# Altium project DB10005_DieBieMS.PrjPcb
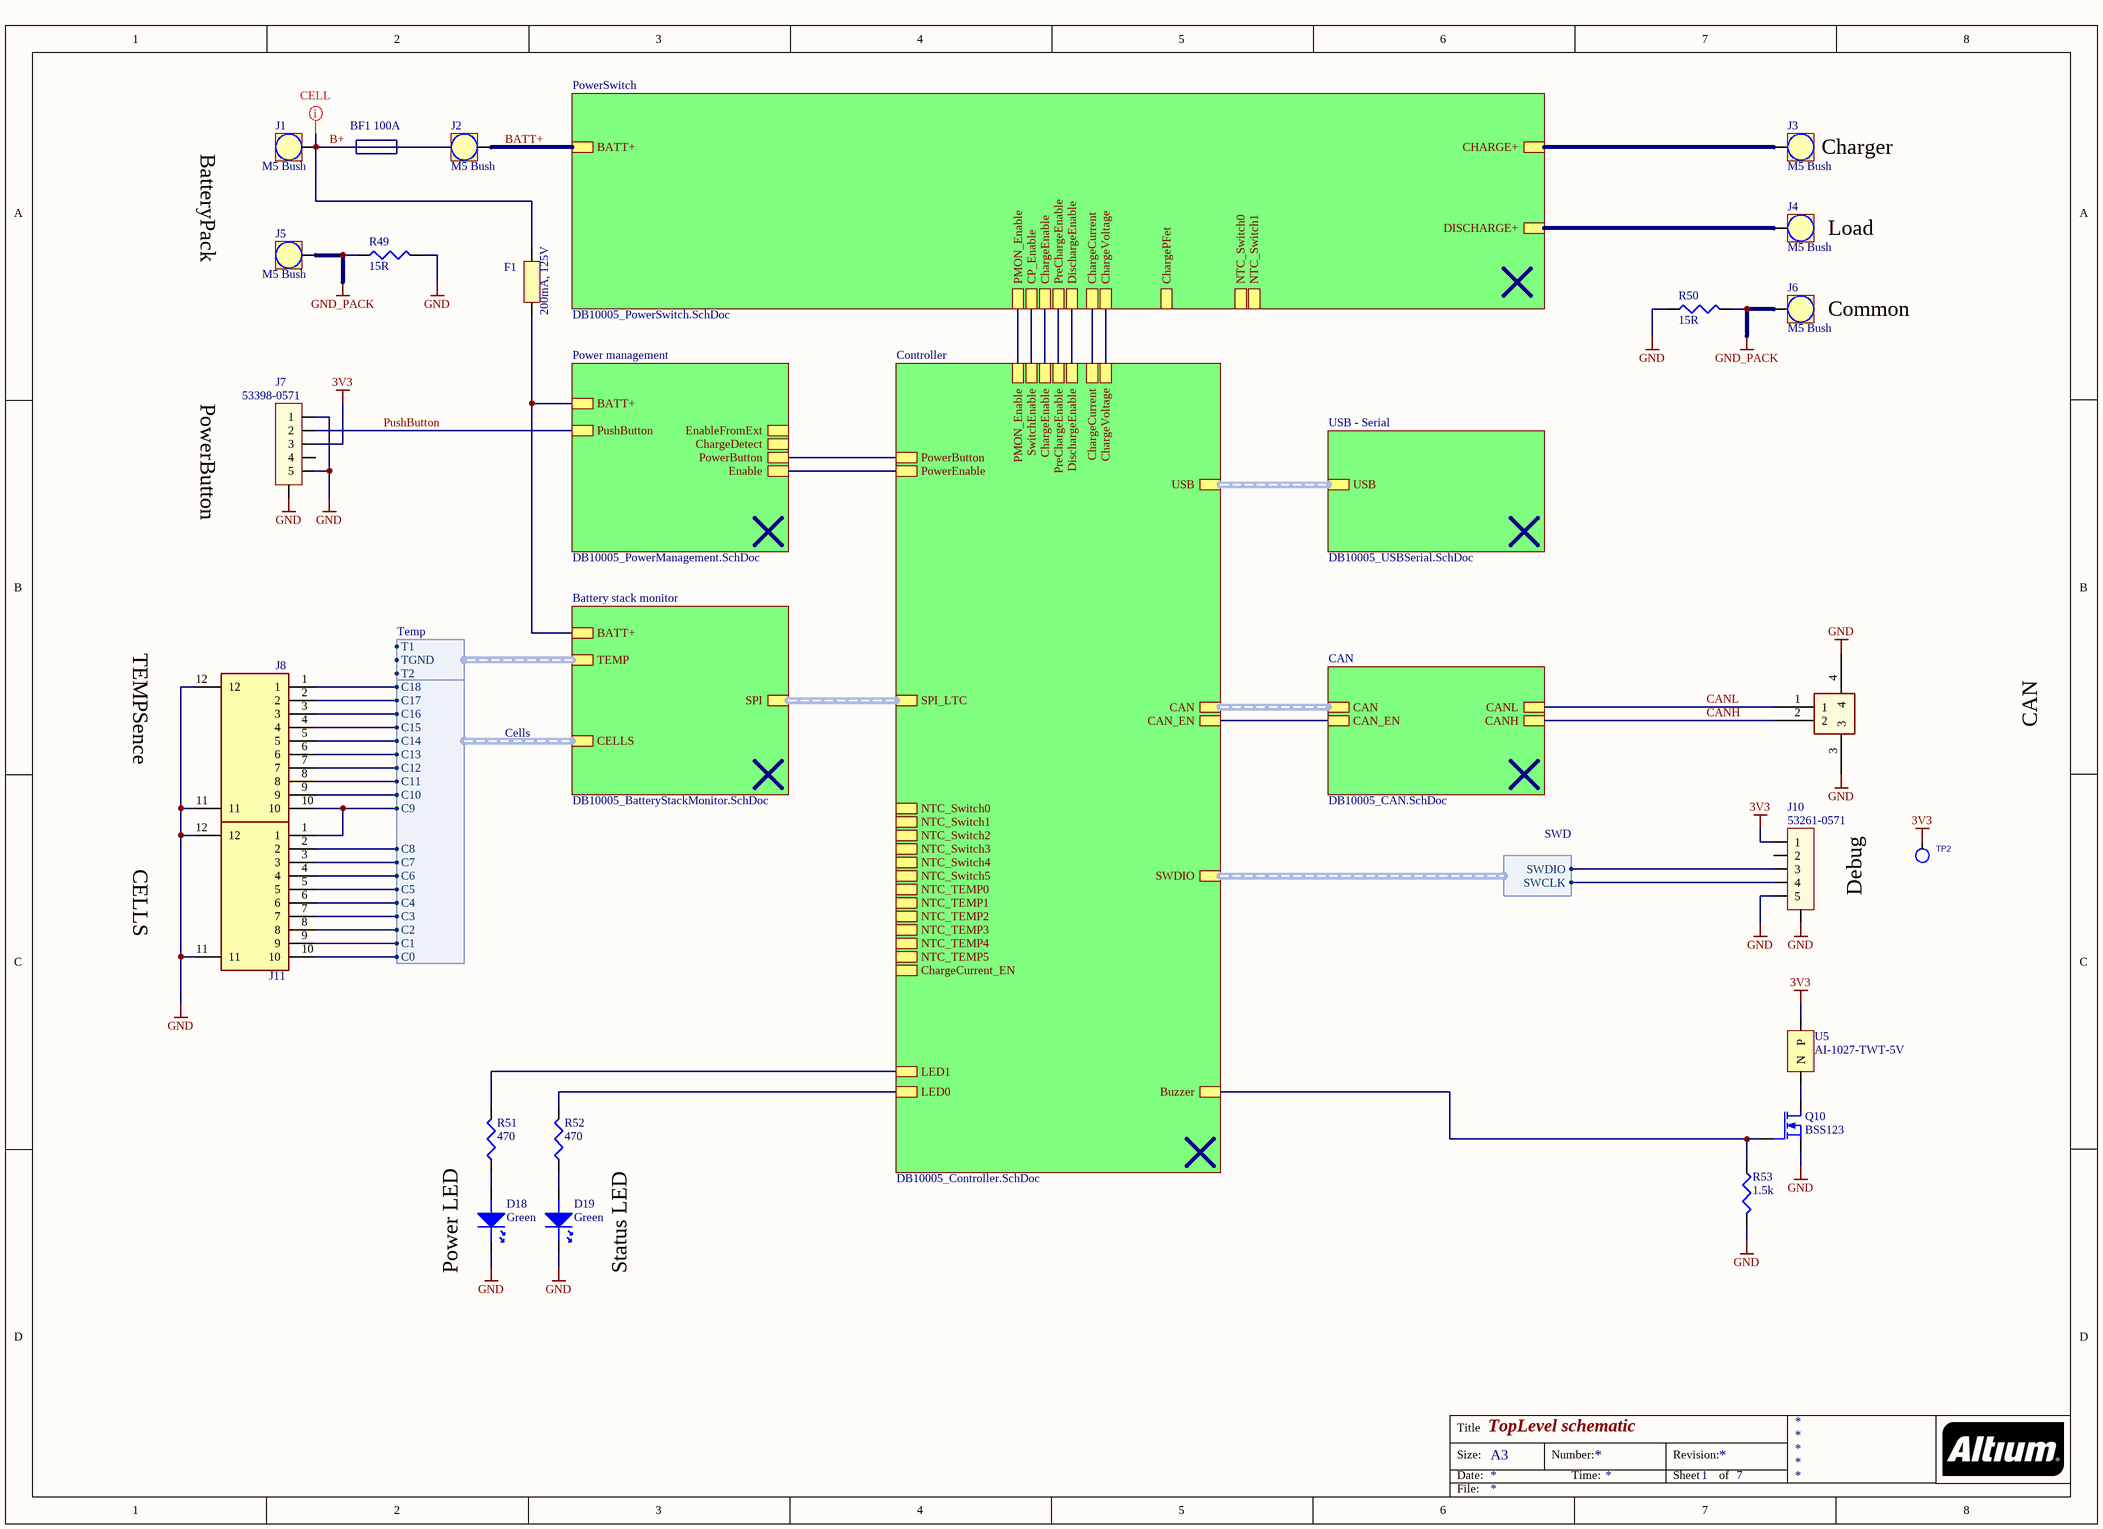
[diagram p0: DB10005_TopLevel.SchDoc]
4 sheets, 51 parts. Net scope: hierarchical (ports join the sheet entries above them; power ports are global).
Board file: DB10005_BMS.PcbDoc
Sheets:
  DB10005_TopLevel.SchDoc
    Battery stack monitor = DB10005_BatteryStackMonitor.SchDoc
    CAN = DB10005_CAN.SchDoc
    USB - Serial = DB10005_USBSerial.SchDoc

## Sheet DB10005_TopLevel.SchDoc: TopLevel schematic
size A3; SheetNumber: 1; SheetTotal: 7

### Parts
D18  Green  [D-0805]
D19  Green  [D-0805]
F1  200mA, 125V  [F1206]
J1  M5 Bush  [7460408_HAL Surface]
J2  M5 Bush  [7460408_HAL Surface]
J3  M5 Bush  [7460408_HAL Surface]
J4  M5 Bush  [7460408_HAL Surface]
J5  M5 Bush  [7460408_HAL Surface]
J6  M5 Bush  [7460408_HAL Surface]
J7  53398-0571  [53398-0571]
J8  S10B-PH-SM4-TB_LF__SN_  [S10B-PH-SM4-TB]  (value not drawn)
J9  1.25-2PWTDK  [BM02B-GHS-TBT_1]  (value not drawn)
J10  53261-0571  [53261-0571]
J11  S10B-PH-SM4-TB_LF__SN_  [S10B-PH-SM4-TB]  (value not drawn)
Q10  BSS123  [SOT-23]
R49  15R  [2512]
R50  15R  [2512]
R51  470  [0402]
R52  470  [0402]
R53  1.5k  [0402]
TP2  1.3TP  [TP2-1.3MM]  (value not drawn)  (no BOM)
U5  AI-1027-TWT-5V  [AI-1027-TWT]

### Sub-sheets
Battery stack monitor = DB10005_BatteryStackMonitor.SchDoc: SPI (harness SPI), CELLS (harness Cells), TEMP (harness Temp), BATT+
CAN = DB10005_CAN.SchDoc: CANH, CAN (harness CAN), CANL, CAN_EN
Controller = DB10005_Controller.SchDoc (file not in this document): SPI_LTC (harness SPI), PowerEnable, PowerButton, DischargeEnable, ChargeEnable, SwitchEnable, PreChargeEnable, CAN (harness CAN), LED0, SWDIO (harness SWD), Buzzer, LED1, PMON_Enable, CAN_EN, ChargeCurrent, ChargeVoltage, NTC_Switch0, NTC_Switch1, NTC_Switch2, NTC_Switch3, NTC_Switch4, NTC_Switch5, NTC_TEMP0, NTC_TEMP1, NTC_TEMP2, NTC_TEMP3, NTC_TEMP4, NTC_TEMP5, ChargeCurrent_EN, USB (harness USB)
Power management = DB10005_PowerManagement.SchDoc (file not in this document): Enable, PowerButton, ChargeDetect, EnableFromExt, PushButton, BATT+
PowerSwitch = DB10005_PowerSwitch.SchDoc (file not in this document): DischargeEnable, ChargeEnable, PreChargeEnable, CHARGE+, DISCHARGE+, BATT+, ChargePFet, CP_Enable, PMON_Enable, NTC_Switch0, NTC_Switch1, ChargeCurrent, ChargeVoltage
USB - Serial = DB10005_USBSerial.SchDoc: USB (harness USB)

### Harnesses
Cells: C1, C9, C2, C3, C4, C5, C6, C7, C8, C10, C11, C0, C12, C13, C14, C15, C16, C17, C18
Temp: T1, T2, TGND
SWD: SWCLK, SWDIO

### Nets
3V3: J7.3 J10.1 TP2.1(TP) U5.P
GND: D18.K D19.K J7.0(SHLD) J7.1 J7.5 J8.11 J8.12 J9.3 J9.4 J10.0(SHLD) J10.5 J11.11 J11.12 Q10.S R49.2 R50.2 R53.2
GND_PACK: J5.1 J6.1 R49.1 R50.1
B+: F1.2 J1.1
BATT+: J2.1 ; sheet PowerSwitch/BATT+
CANH: J9.2 ; sheet CAN/CANH
CANL: J9.1 ; sheet CAN/CANL
CN1: J11.10 ; sheet Battery stack monitor/CELLS.C0
CN2: J11.9 ; sheet Battery stack monitor/CELLS.C1
CN3: J11.8 ; sheet Battery stack monitor/CELLS.C2
CN4: J11.7 ; sheet Battery stack monitor/CELLS.C3
CN5: J11.6 ; sheet Battery stack monitor/CELLS.C4
CN6: J11.5 ; sheet Battery stack monitor/CELLS.C5
CN7: J11.4 ; sheet Battery stack monitor/CELLS.C6
CN8: J11.3 ; sheet Battery stack monitor/CELLS.C7
CN9: J11.2 ; sheet Battery stack monitor/CELLS.C8
CN10: J8.10 J11.1 ; sheet Battery stack monitor/CELLS.C9
CN11: J8.9 ; sheet Battery stack monitor/CELLS.C10
CN12: J8.8 ; sheet Battery stack monitor/CELLS.C11
CN13: J8.7 ; sheet Battery stack monitor/CELLS.C12
CN14: J8.6 ; sheet Battery stack monitor/CELLS.C13
CN15: J8.5 ; sheet Battery stack monitor/CELLS.C14
CN16: J8.4 ; sheet Battery stack monitor/CELLS.C15
CN17: J8.3 ; sheet Battery stack monitor/CELLS.C16
CN18: J8.2 ; sheet Battery stack monitor/CELLS.C17
CP18: J8.1 ; sheet Battery stack monitor/CELLS.C18
PushButton: J7.2 ; sheet Power management/PushButton
NetD18_A: D18.A R51.1
NetD19_A: D19.A R52.1
NetF1_1: F1.1 ; sheet Battery stack monitor/BATT+, sheet Power management/BATT+
NetJ3_1: J3.1 ; sheet PowerSwitch/CHARGE+
NetJ4_1: J4.1 ; sheet PowerSwitch/DISCHARGE+
NetJ10_3: J10.3 ; sheet Controller/SWDIO.SWDIO
NetJ10_4: J10.4 ; sheet Controller/SWDIO.SWCLK
NetQ10_D: Q10.D U5.N
NetQ10_G: Q10.G R53.1 ; sheet Controller/Buzzer
NetR51_2: R51.2 ; sheet Controller/LED1
NetR52_2: R52.2 ; sheet Controller/LED0
NetU6_8: sheet Controller/CAN_EN, sheet CAN/CAN_EN
(unnamed): sheet Controller/PowerEnable, sheet Power management/Enable
(unnamed): sheet Controller/PowerButton, sheet Power management/PowerButton
(unnamed): sheet Controller/DischargeEnable, sheet PowerSwitch/DischargeEnable
(unnamed): sheet Controller/ChargeEnable, sheet PowerSwitch/ChargeEnable
(unnamed): sheet Controller/SwitchEnable, sheet PowerSwitch/CP_Enable
(unnamed): sheet Controller/PreChargeEnable, sheet PowerSwitch/PreChargeEnable
(unnamed): sheet Controller/PMON_Enable, sheet PowerSwitch/PMON_Enable
(unnamed): sheet Controller/ChargeCurrent, sheet PowerSwitch/ChargeCurrent
(unnamed): sheet Controller/ChargeVoltage, sheet PowerSwitch/ChargeVoltage

Not connected (* = marked no-connect by the designer): J7 4; J10 2

### Buses and harness runs
harness sheet Battery stack monitor/SPI = sheet Controller/SPI_LTC
harness sheet CAN/CAN = sheet Controller/CAN
harness sheet Controller/USB = sheet USB - Serial/USB

### Layout directives
net class CELL: B+

### Notes on the sheet
- (near J1) BF1 100A
- BatteryPack
- (near J3) Charger
- (near J4) Load
- (near J6) Common
- PowerButton
- TEMPSence
- CAN
- CELLS
- Debug
- Power LED
- Status LED
- Title
- Size:
- Date:
- A3
- Number:
- Time:
- Revision:
- Sheet
- of
- File:

### Library data of the parts
D18 D19 = KP-2012SGC: Led, Green, Li:12mcd, Vf:2.2V, If:0.02A; Brand: KingBright; Case Style: 0805; Forward Current: 0.02A; Forward Voltage: 2.2V; Luminous Intensity: 12mcd; Brand Number: KP-2012SGC; Order Code Supplier: 1318243; Price: 0,06; Supplier: Farnell; Temperature Range: -30°C to +85°C
F1 = 0466.200NR: Fuse, Slow Blow, 200 mA, 125 VAC, 125 VDC; Brand: LITTELFUSE; Prijs: 0,347; Order Code Supplier: 1596522; Brand Number: 0466.200NR; Supplier: Farnell
J1-J6 = 7460408: Bush with Circumference M5; Brand: Wurth; Case Style: M5Bush; Brand Number: 7460408; Order Code Supplier: 1821279; Price: 4,17; Supplier: Farnell
J7 = 53398-0571: PicoBlade 53398 Series, 5Pin, Right Angle; Brand: MOLEX; Pitch: 1.25mm; Brand Number: 53398-0571; Case Style: 53398-0571; Order Code Supplier: 1125354; Price: 1,55; Supplier: Farnell
J8 J11 = S10B-PH-SM4-TB_LF__SN_: Connector; Manufacturer_Name: JST (JAPAN SOLDERLESS TERMINALS); Manufacturer_Part_Number: S10B-PH-SM4-TB(LF)(SN); Description: PH SMT side entry shroud header 10 way JST PH Series; Datasheet Link: http://uk.rs-online.com/web/p/products/6881350; Mouser Part Number: 306-S10BPHSM4TBLFSN; Mouser Price/Stock: https://www.mouser.co.uk/ProductDetail/JST-Commercial/S10B-PH-SM4-TBLFSN?qs=QpmGXVUTftH7ZRPAPdrNVw%3D%3D; Arrow Part Number: S10B-PH-SM4-TB(LF)(SN); Arrow Price/Stock: https://www.arrow.com/en/products/s10b-ph-sm4-tb-lf-sn/jst-manufacturing?region=nac
J10 = 53261-0571: PicoBlade 53261 Series, 5Pin, Right Angle; Brand: MOLEX; Pitch: 1.25mm; Brand Number: 53261-0571; Case Style: 53261-0571; Order Code Supplier: 1125360; Price: 1,20; Supplier: Farnell
Q10 = BSS123: Mosfet, N-channel, Vds:100V, Id:0.15A, Vgs-th:2.8V, Rds-on:3.5ohm; Brand: NXP; Drain Current: 0.15A; Drain Source Voltage: 100V; Gate Source Voltage: 20V; On Resistance: 3.5ohm; Threshold Voltage: 2.8V; Brand Number: BSS123; Case Style: SOT-23; Order Code Supplier: 1510764; Price: 0,082; Supplier: Farnell; Temperature Range: -55°C to +150°C; Transistor Polarity: N-channel
R49 R50 = 15/2512/2W/250V: Resistor, 15R, 1%, 2W, 200V, 200PPM, 2512; Brand: TE CONNECTIVITY / CGS; Brand Number: 352115RFT; Voltage Rating: 250V; Case Style: 2512; Order Code Supplier: 2117454; Power Rating: 2W; Price: 0,30; Resistance: 15R; Supplier: Farnell; Temperature Coefficient: ± 200PPM; Temperature Range: -55°C to +125°C
R51 R52 = 470/0402/0063W/50V: Resistor, 470, 1%, 0.0625W, 50V, 100PPM, 0402; Brand: VISHAY DRALORIC; Brand Number: CRG0402F470R; Power Rating: 0.063W; Case Style: 0402; Order Code Supplier: 2331533; Price: 0,0099; Resistance: 470; Supplier: Farnell; Temperature Coefficient: ± 100PPM; Temperature Range: -55°C to +125°C; Voltage Rating: 50V
R53 = 1.5k/0402/0063W/50V: Resistor, 1.5k, 0.1%, 0.0625W, 50V, 100PPM, 0402; Brand: VISHAY DRALORIC; Brand Number: CRCW04021K50FKED; Power Rating: 0.063W; Case Style: 0402; Order Code Supplier: 2121624; Price: 0,0054; Resistance: 1.5k; Supplier: Farnell; Temperature Coefficient: ± 100PPM; Temperature Range: -55°C to +125°C; Voltage Rating: 50V
TP2 = TESTPT4: 1.3mm
U5 = AI-1027-TWT-5V-2-R: EM 5VDC 2300Hz 82dBA Continuous Top Fire; Brand: PUI Audio; Brand Number: AI-1027-TWT-5V-2-R; Case Style: AI-1027-TWT-5V-2-R; Price: 1,73; Order Code Supplier: 665-AI1027TWT5V2R; Supplier: Mouser

## Sheet DB10005_BatteryStackMonitor.SchDoc: Battery stack monitor
size A3; SheetNumber: 2; SheetTotal: 7
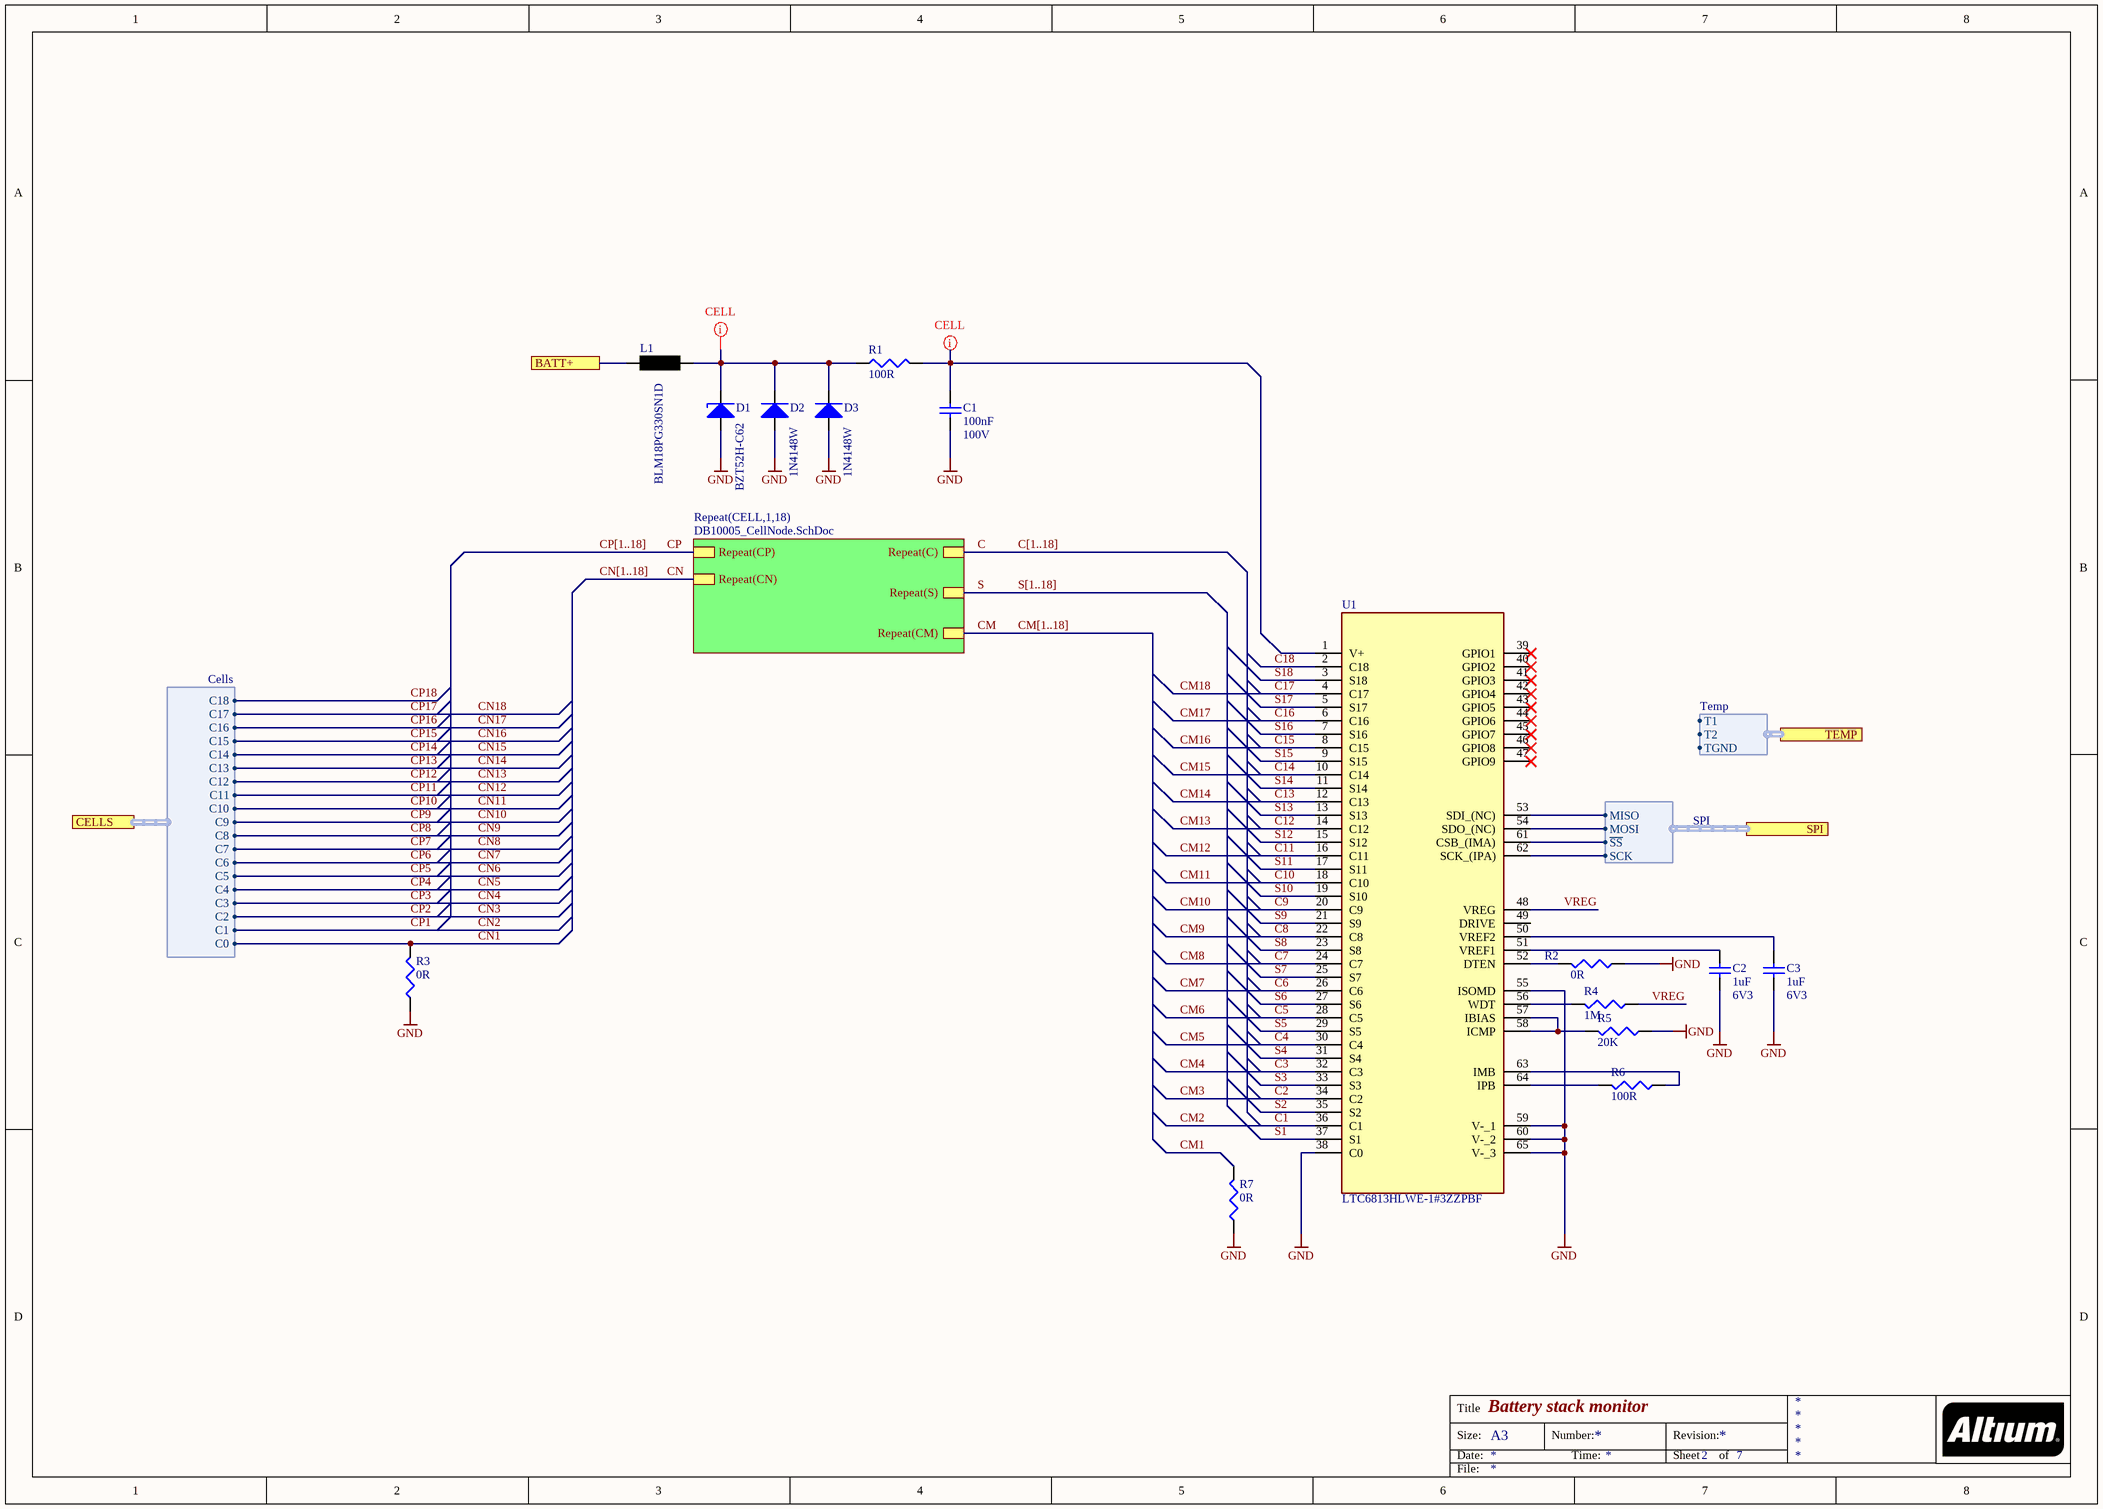
[diagram p1: DB10005_BatteryStackMonitor.SchDoc]

### Parts
C1  100nF  Voltage Rating: 100V  [C-0805]
C2  1uF  Voltage Rating: 6V3  [C0402]
C3  1uF  Voltage Rating: 6V3  [C0402]
D1  BZT52H-C62  [SOD123W]
D2  1N4148W  [SOD123]
D3  1N4148W  [SOD123]
L1  BLM18PG330SN1D  [L0603]
R1  100R  [0603]
R2  0R  [0603]
R3  0R  [0603]
R4  1M  [0402]
R5  20K  [0402]
R6  100R  [0402]
R7  0R  [0603]
U1  LTC6813HLWE-1#3ZZPBF  [QFP50P1200X1200X160-65N]

### Sub-sheets
Repeat(CELL,1,18) = DB10005_CellNode.SchDoc (file not in this document): Repeat(CN), Repeat(CP), Repeat(S), Repeat(C), Repeat(CM)

### Ports
BATT+, CELLS (harness Cells), SPI (harness SPI), TEMP (harness Temp)

### Harnesses
SPI: ~{SS}, SCK, MISO, MOSI
Cells: C1, C9, C2, C3, C4, C5, C6, C7, C8, C10, C11, C0, C12, C13, C14, C15, C16, C17, C18
Temp: T1, T2, TGND

### Nets
GND: C1.1 C2.2 C3.2 D1.1 D2.1(A) D3.1(A) R2.1 R3.1 R5.1 R7.1 U1.38(C0) U1.55(ISOMD) U1.59(V-_1) U1.60(V-_2) U1.65(V-_3)
C: sheet Repeat(CELL,1,18)/Repeat(C)
C1: U1.36(C1)  [also labelled CM2]
C2: U1.34(C2)  [also labelled CM3]
C3: U1.32(C3)  [also labelled CM4]
C4: U1.30(C4)  [also labelled CM5]
C5: U1.28(C5)  [also labelled CM6]
C6: U1.26(C6)  [also labelled CM7]
C7: U1.24(C7)  [also labelled CM8]
C8: U1.22(C8)  [also labelled CM9]
C9: U1.20(C9)  [also labelled CM10]
C10: U1.18(C10)  [also labelled CM11]
C11: U1.16(C11)  [also labelled CM12]
C12: U1.14(C12)  [also labelled CM13]
C13: U1.12(C13)  [also labelled CM14]
C14: U1.10(C14)  [also labelled CM15]
C15: U1.8(C15)  [also labelled CM16]
C16: U1.6(C16)  [also labelled CM17]
C17: U1.4(C17)  [also labelled CM18]
C18: U1.2(C18)
CM: sheet Repeat(CELL,1,18)/Repeat(CM)
CM1: R7.2
CN: sheet Repeat(CELL,1,18)/Repeat(CN)
CN1: R3.2 ; port CELLS.C0
CP: sheet Repeat(CELL,1,18)/Repeat(CP)
S: sheet Repeat(CELL,1,18)/Repeat(S)
S1: U1.37(S1)
S2: U1.35(S2)
S3: U1.33(S3)
S4: U1.31(S4)
S5: U1.29(S5)
S6: U1.27(S6)
S7: U1.25(S7)
S8: U1.23(S8)
S9: U1.21(S9)
S10: U1.19(S10)
S11: U1.17(S11)
S12: U1.15(S12)
S13: U1.13(S13)
S14: U1.11(S14)
S15: U1.9(S15)
S16: U1.7(S16)
S17: U1.5(S17)
S18: U1.3(S18)
VREG: R4.1 U1.48(VREG)
NetC1_2: C1.2 R1.2 U1.1(V+)
NetC2_1: C2.1 U1.51(VREF1)
NetC3_1: C3.1 U1.50(VREF2)
NetD1_2: D1.2 D2.2(K) D3.2(K) L1.2 R1.1
NetF1_1: L1.1 ; port BATT+
NetR2_2: R2.2 U1.52(DTEN)
NetR4_2: R4.2 U1.56(WDT)
NetR5_2: R5.2 U1.57(IBIAS) U1.58(ICMP)
NetR6_1: R6.1 U1.63(IMB)
NetR6_2: R6.2 U1.64(IPB)
NetU1_53: U1.53(SDI_(NC)) ; port SPI.MISO
NetU1_54: U1.54(SDO_(NC)) ; port SPI.MOSI
NetU1_61: U1.61(CSB_(IMA)) ; port SPI.~{SS}
NetU1_62: U1.62(SCK_(IPA)) ; port SPI.SCK

Not connected (* = marked no-connect by the designer): U1 39(GPIO1)* 40(GPIO2)* 41(GPIO3)* 42(GPIO4)* 43(GPIO5)* 44(GPIO6)* 45(GPIO7)* 46(GPIO8)* 47(GPIO9)* 49(DRIVE)

### Buses and harness runs
bus C[1..18]
bus CM[1..18]
bus CN[1..18]
bus CP[1..18]
bus S[1..18]

### Layout directives
net class CELL: NetC1_2, NetD1_2

### Notes on the sheet
- Title
- Size:
- Date:
- A3
- Number:
- Time:
- Revision:
- Sheet
- of
- File:

### Library data of the parts
C1 = 100nF/0805/CER/100V: Capacitor, 100nF, 100V, X7R; Capacitance Tolerance: ± 10%; Capacitor Case Style: 0805; Brand Number: C0805C104K1RACTU; Brand: KEMET; Dielectric Characteristic: X7R; Capacitance: 100nF; Temperature Range: -55°C to +125°C; Price: 0,096; Order Code Supplier: 1650862; Supplier: Farnell
C2 C3 = 1uF/0402/CER/6.3V: Capacitor, 1uF, 6.3V, X5R; Capacitance Tolerance: ± 10%; Capacitor Case Style: 0402; Brand Number: 04026D105KAT2A; Brand: AVX; Dielectric Characteristic: X5R; Capacitance: 1uF; Temperature Range: -55°C to +85°C; Price: 0,0874; Order Code Supplier: 1327658; Supplier: Farnell
D1 = BZT52H-C62,115: Diode Zener, Vz: 62V, If: 0.25A, Vf: 0.9V; Brand: NXP; Case Style: SOD-123F; Brand Number: BZT52H-C62,115; Forward Current: 0.25A; Forward Voltage: 0.9V; Order Code Supplier: 1757813RL; Price: 0,053; Supplier: Farnell; Temperature Range: -65°C to +150°C; Zener Voltage: 62V
D2 D3 = MMSD4148T1G: Diode, Vrrm: 100V, If: 0.15A, Vf: 1V; Brand: ON SEMICONDUCTOR; Case Style: SOD-123; Forward Current: 0.2A; Brand Number: MMSD4148T1G; Forward Voltage: 1V; Order Code Supplier: 9556079; Price: 0,19; Supplier: Farnell; Temperature Range: -65°C to +150°C; Vrrm: 100V
L1 = BLM18PG330SN1D: Ferrite Bead, Impedance:33ohm, DC Resistance Max:0.025ohm, DC Current Rating:3A; Brand: MURATA; Case Style: 0603; Brand Number: BLM18PG330SN1D; Price: 0,048; Supplier: Farnell; Order Code Supplier: 1515742
R1 = 100/0603/0063W/50V: Resistor, 100R, 1%, 0.063W, 50V, 200PPM, 0603; Brand: VISHAY DRALORIC; Brand Number: CRCW0603100RFKEA; Case Style: 0603; Order Code Supplier: 2122239; Power Rating: 0.063W; Price: 0,007; Resistance: 100R; Supplier: Farnell; Temperature Coefficient: ± 200PPM; Temperature Range: -55°C to +125°C; Voltage Rating: 50V
R2 R3 R7 = 0/0603/0063W/50V: Resistor, 0R, 0.1%, 0.063W, 50V, 200PPM, 0603; Brand: VISHAY DRALORIC; Brand Number: CRCW06030000Z0EA; Case Style: 0603; Order Code Supplier: 2122112; Power Rating: 0.063W; Price: 0,043; Resistance: 0R; Supplier: Farnell; Temperature Coefficient: ± 200PPM; Temperature Range: -55°C to +125°C; Voltage Rating: 50V
R4-R6 = 1M/0402/0063W/50V: Resistor, 1M, 0.1%, 0.0625W, 50V, 100PPM, 0402; Brand: VISHAY DRALORIC; Brand Number: CRCW04021M00FKED; Power Rating: 0.063W; Case Style: 0402; Order Code Supplier: 2121984; Price: 0,0006; Resistance: 1M; Supplier: Farnell; Temperature Coefficient: ± 100PPM; Temperature Range: -55°C to +125°C; Voltage Rating: 50V
U1 = LTC6813HLWE-1#3ZZPBF: Integrated Circuit; Manufacturer_Name: Analog Devices; Datasheet Link: https://www.analog.com/media/en/technical-documentation/data-sheets/LTC6813-1.pdf; Height: 1.6mm; Manufacturer_Part_Number: LTC6813HLWE-1#3ZZPBF; Mouser Part Number: 584-6813HLWE13ZZPBF; Mouser Price/Stock: https://www.mouser.co.uk/ProductDetail/Analog-Devices-Linear-Technology/LTC6813HLWE-13ZZPBF?qs=lYGu3FyN48e3Qu9IYnRGuQ%3D%3D; Arrow Part Number: LTC6813HLWE-1#3ZZPBF; Arrow Price/Stock: https://www.arrow.com/en/products/ltc6813hlwe-13zzpbf/linear-technology

## Sheet DB10005_CAN.SchDoc: CAN interface
size A4; SheetNumber: 6; SheetTotal: 7
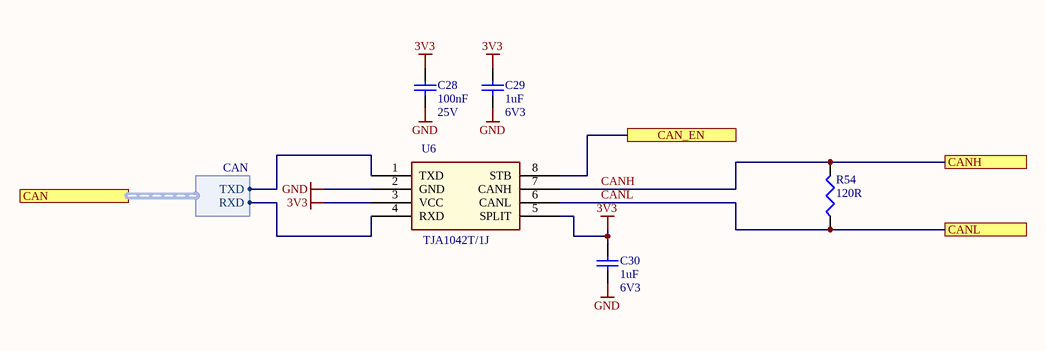
[diagram p2: DB10005_CAN.SchDoc]

### Parts
C28  100nF  Voltage Rating: 25V  [C0402]
C29  1uF  Voltage Rating: 6V3  [C0402]
C30  1uF  Voltage Rating: 6V3  [C0402]
R54  120R  [0805]
U6  TJA1042T/1J  [SOP-8]

### Ports
CAN (harness CAN), CAN_EN, CANH, CANL

### Harnesses
CAN: RXD, TXD

### Nets
3V3: C28.2 C29.2 C30.2 U6.3(VCC) U6.5(SPLIT)
GND: C28.1 C29.1 C30.1 U6.2(GND)
CANH: R54.2 U6.7(CANH) ; port CANH
CANL: R54.1 U6.6(CANL) ; port CANL
NetU6_1: U6.1(TXD) ; port CAN.TXD
NetU6_4: U6.4(RXD) ; port CAN.RXD
NetU6_8: U6.8(STB) ; port CAN_EN

### Notes on the sheet
- Title
- Size:
- Date:
- A4
- Number:
- Time:
- Revision:
- Sheet
- of
- File:

### Library data of the parts
C28 = 100nF/0402/CER/25V: Capacitor, 100nF, 25V, X7R; Capacitance Tolerance: 10nF; Capacitor Case Style: 0402; Brand Number: GRM155R71E104KE14D; Brand: MULTICOMP; Dielectric Characteristic: X7R; Capacitance: 100nF; Temperature Range: -55 to +125 C; Price: 0,0225; Order Code Supplier: 2456106; Supplier: Farnell
C29 C30 = 1uF/0402/CER/6.3V: as C2 on sheet DB10005_BatteryStackMonitor; Dielectric Characteristic: X5R; Capacitance: 1uF; Temperature Range: -55°C to +85°C; Price: 0,0874; Order Code Supplier: 1327658; Supplier: Farnell
R54 = 0/0805/0100W/150V: Resistor, 0R, 0.1%, 0.1W, 150V, 200PPM, 0805; Brand: MULTICOMP; Brand Number: MC 0.1W 0805 0R; Case Style: 0805; Order Code Supplier: 9333681; Power Rating: 0.1W; Price: 0,038; Resistance: 0R; Supplier: Farnell; Temperature Coefficient: ± 200PPM; Temperature Range: -55°C to +125°C; Voltage Rating: 150V

## Sheet DB10005_USBSerial.SchDoc: USB Serial interface
size A4; SheetNumber: 7; SheetTotal: 7
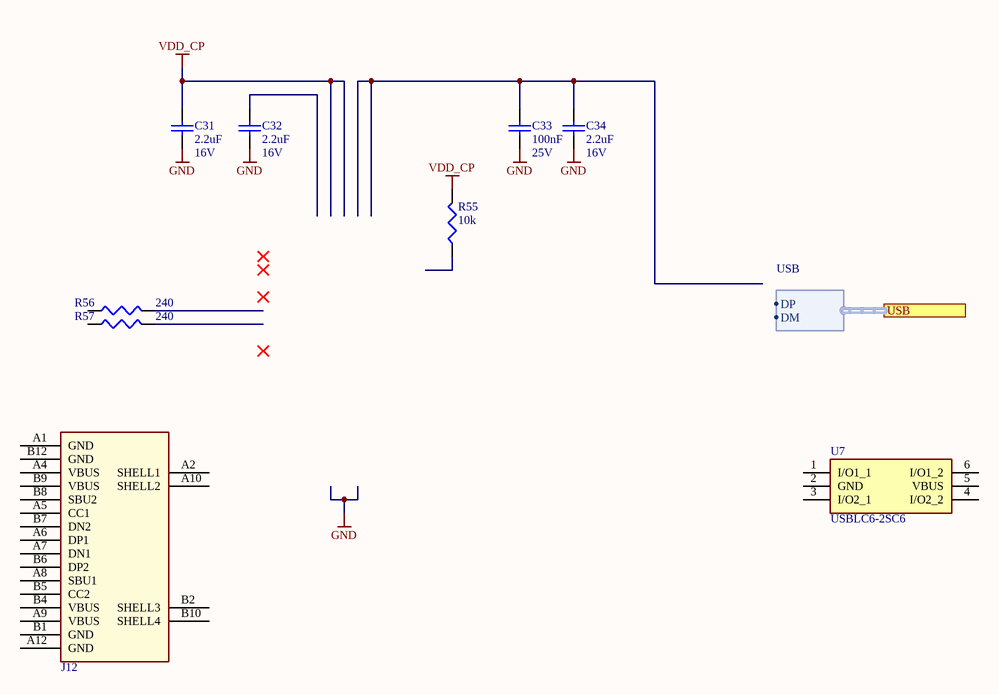
[diagram p3: DB10005_USBSerial.SchDoc]

### Parts
C31  2.2uF  Voltage Rating: 16V  [C0603]
C32  2.2uF  Voltage Rating: 16V  [C0603]
C33  100nF  Voltage Rating: 25V  [C0402]
C34  2.2uF  Voltage Rating: 16V  [C0603]
J12  TYPE-C 16PLC-H10.0  [TYPE-C-TH_16PLC-H10.0]  (value not drawn)
R55  10k  [0402]
R56  240  [0402]
R57  240  [0402]
U7  USBLC6-2SC6  [SOT95P280X145-6N]

### Ports
USB (harness USB)

### Harnesses
USB: DM, DP

### Nets
GND: C31.1 C32.1 C33.1 C34.1
VDD_CP: C31.2 R55.2
NetC33_2: C33.2 C34.2

Not connected (* = marked no-connect by the designer): C32 2; J12 A1(GND) A2(SHELL1) A4(VBUS) A5(CC1) A6(DP1) A7(DN1) A8(SBU1) A9(VBUS) A10(SHELL2) A12(GND) B1(GND) B2(SHELL3) B4(VBUS) B5(CC2) B6(DP2) B7(DN2) B8(SBU2) B9(VBUS) B10(SHELL4) B12(GND); R55 1; R56 1 2; R57 1 2; U7 1(I/O1_1) 2(GND) 3(I/O2_1) 4(I/O2_2) 5(VBUS) 6(I/O1_2)

### Notes on the sheet
- Title
- Size:
- Date:
- A4
- Number:
- Time:
- Revision:
- Sheet
- of
- File:

### Library data of the parts
C31 C32 C34 = 2.2uF/0603/CER/16V: Capacitor, 2.2uF, 16V, X5R; Capacitance Tolerance: +/- 10%; Capacitor Case Style: 0603; Brand Number: GRM188R61C225KE15D; Brand: MURATA; Dielectric Characteristic: X5R; Capacitance: 2.2uF; Temperature Range: -55°C to 85°C; Price: 0,077; Order Code Supplier: 1735526; Supplier: Farnell
C33 = 100nF/0402/CER/25V: as C28 on sheet DB10005_CAN; Dielectric Characteristic: X7R; Capacitance: 100nF; Temperature Range: -55 to +125 C; Price: 0,0225; Order Code Supplier: 2456106; Supplier: Farnell
J12 = TYPE-C 16PLC-H10.0: 连接器类型:Type-C;标准:USB 3.1;公母:母;安装方式:直插;触点数量:16P;端口数量:1;额定电流 - 电源:5A;触头材质:-;触头镀层:-;工作温度范围:-40℃~+85℃;; Manufacturer: SHOU HAN(首韩); Add into BOM: yes; Gender: 母; Number of Contacts: 16P; Number of Ports: 1; Current Rating - Power (Max): 5A; Rated Voltage (Max): 20V; Connect-Disconnect Life: 1万次; Core Colour: 黑色; Symbol: TYPE-C 16PLC-H10.0; Device: TYPE-C 16PLC-H10.0; LCSC Part Name: Type-C 母 直插; Supplier Part: C3151747; Manufacturer Part: TYPE-C 16PLC-H10.0; Supplier Footprint: 插件; Datasheet: https://atta.szlcsc.com/upload/public/pdf/source/20240529/CC9428849977884A813B584EA396EFE9.pdf; Supplier: LCSC; Convert to PCB: yes; Connector Type: Type-C; Standard: USB 3.1; Mounting Style: 直插; Contact Material: -; Contact Plating: -; Operating Temperature Range: -40℃~+85℃
R55 = 10k/0402/0063W/50V: Resistor, 10k, 0.1%, 0.0625W, 50V, 100PPM, 0402; Brand: VISHAY DRALORIC; Brand Number: CRCW040210K0FKED; Power Rating: 0.063W; Case Style: 0402; Order Code Supplier: 2121730; Price: 0,0005; Resistance: 10k; Supplier: Farnell; Temperature Coefficient: ± 100PPM; Temperature Range: -55°C to +125°C; Voltage Rating: 50V
R56 R57 = 240/0402/0063W/50V: Resistor, 240, 0.1%, 0.0625W, 50V, 100PPM, 0402; Brand: VISHAY DRALORIC; Brand Number: CRCW0402240RFKED; Power Rating: 0.063W; Case Style: 0402; Order Code Supplier: 2121522; Price: 0,0006; Resistance: 240; Supplier: Farnell; Temperature Coefficient: ± 100PPM; Temperature Range: -55°C to +125°C; Voltage Rating: 50V
U7 = USBLC6-2SC6: Integrated Circuit; Manufacturer_Name: STMicroelectronics; Datasheet Link: http://www.st.com/st-web-ui/static/active/en/resource/technical/document/datasheet/CD00050750.pdf; Height: 1.45mm; Manufacturer_Part_Number: USBLC6-2SC6; Mouser Part Number: 511-USBLC6-2SC6; Mouser Price/Stock: https://www.mouser.co.uk/ProductDetail/STMicroelectronics/USBLC6-2SC6?qs=po45yt2pPpu%2FhNIlwQdTlg%3D%3D; Arrow Part Number: USBLC6-2SC6; Arrow Price/Stock: https://www.arrow.com/en/products/usblc6-2sc6/stmicroelectronics?utm_currency=USD&region=europe

## Nets that join several sheets
3V3: DB10005_TopLevel (J7.3 J10.1 TP2.1 U5.P), DB10005_CAN (5 pins)
GND: DB10005_TopLevel (17 pins), DB10005_BatteryStackMonitor (15 pins), DB10005_CAN (C28.1 C29.1 C30.1 U6.2), DB10005_USBSerial (C31.1 C32.1 C33.1 C34.1)
CANH: DB10005_TopLevel (J9.2), DB10005_CAN (R54.2 U6.7)
CANL: DB10005_TopLevel (J9.1), DB10005_CAN (R54.1 U6.6)
CN1: DB10005_TopLevel (J11.10), DB10005_BatteryStackMonitor (R3.2)
NetF1_1: DB10005_TopLevel (F1.1), DB10005_BatteryStackMonitor (L1.1)

## Assembly variants
Production: not fitted C6 C8 C26 J15 L3 L4 MOD1 R39_CELL1 R39_CELL2 R39_CELL3 R39_CELL4 R39_CELL5 R39_CELL6 R39_CELL7 R39_CELL8 R39_CELL9 R39_CELL10 R39_CELL11 R39_CELL12 R64 R69 R71